# EasyEDA schematic SCH_Satlla_4_Motor_plate_2023-01-29.json
TITLE: Motor board; REV: 1.0; Date: 2021-09-02; Sheet: 1/1; Drawn By: KCG LAB; Company: Your Company
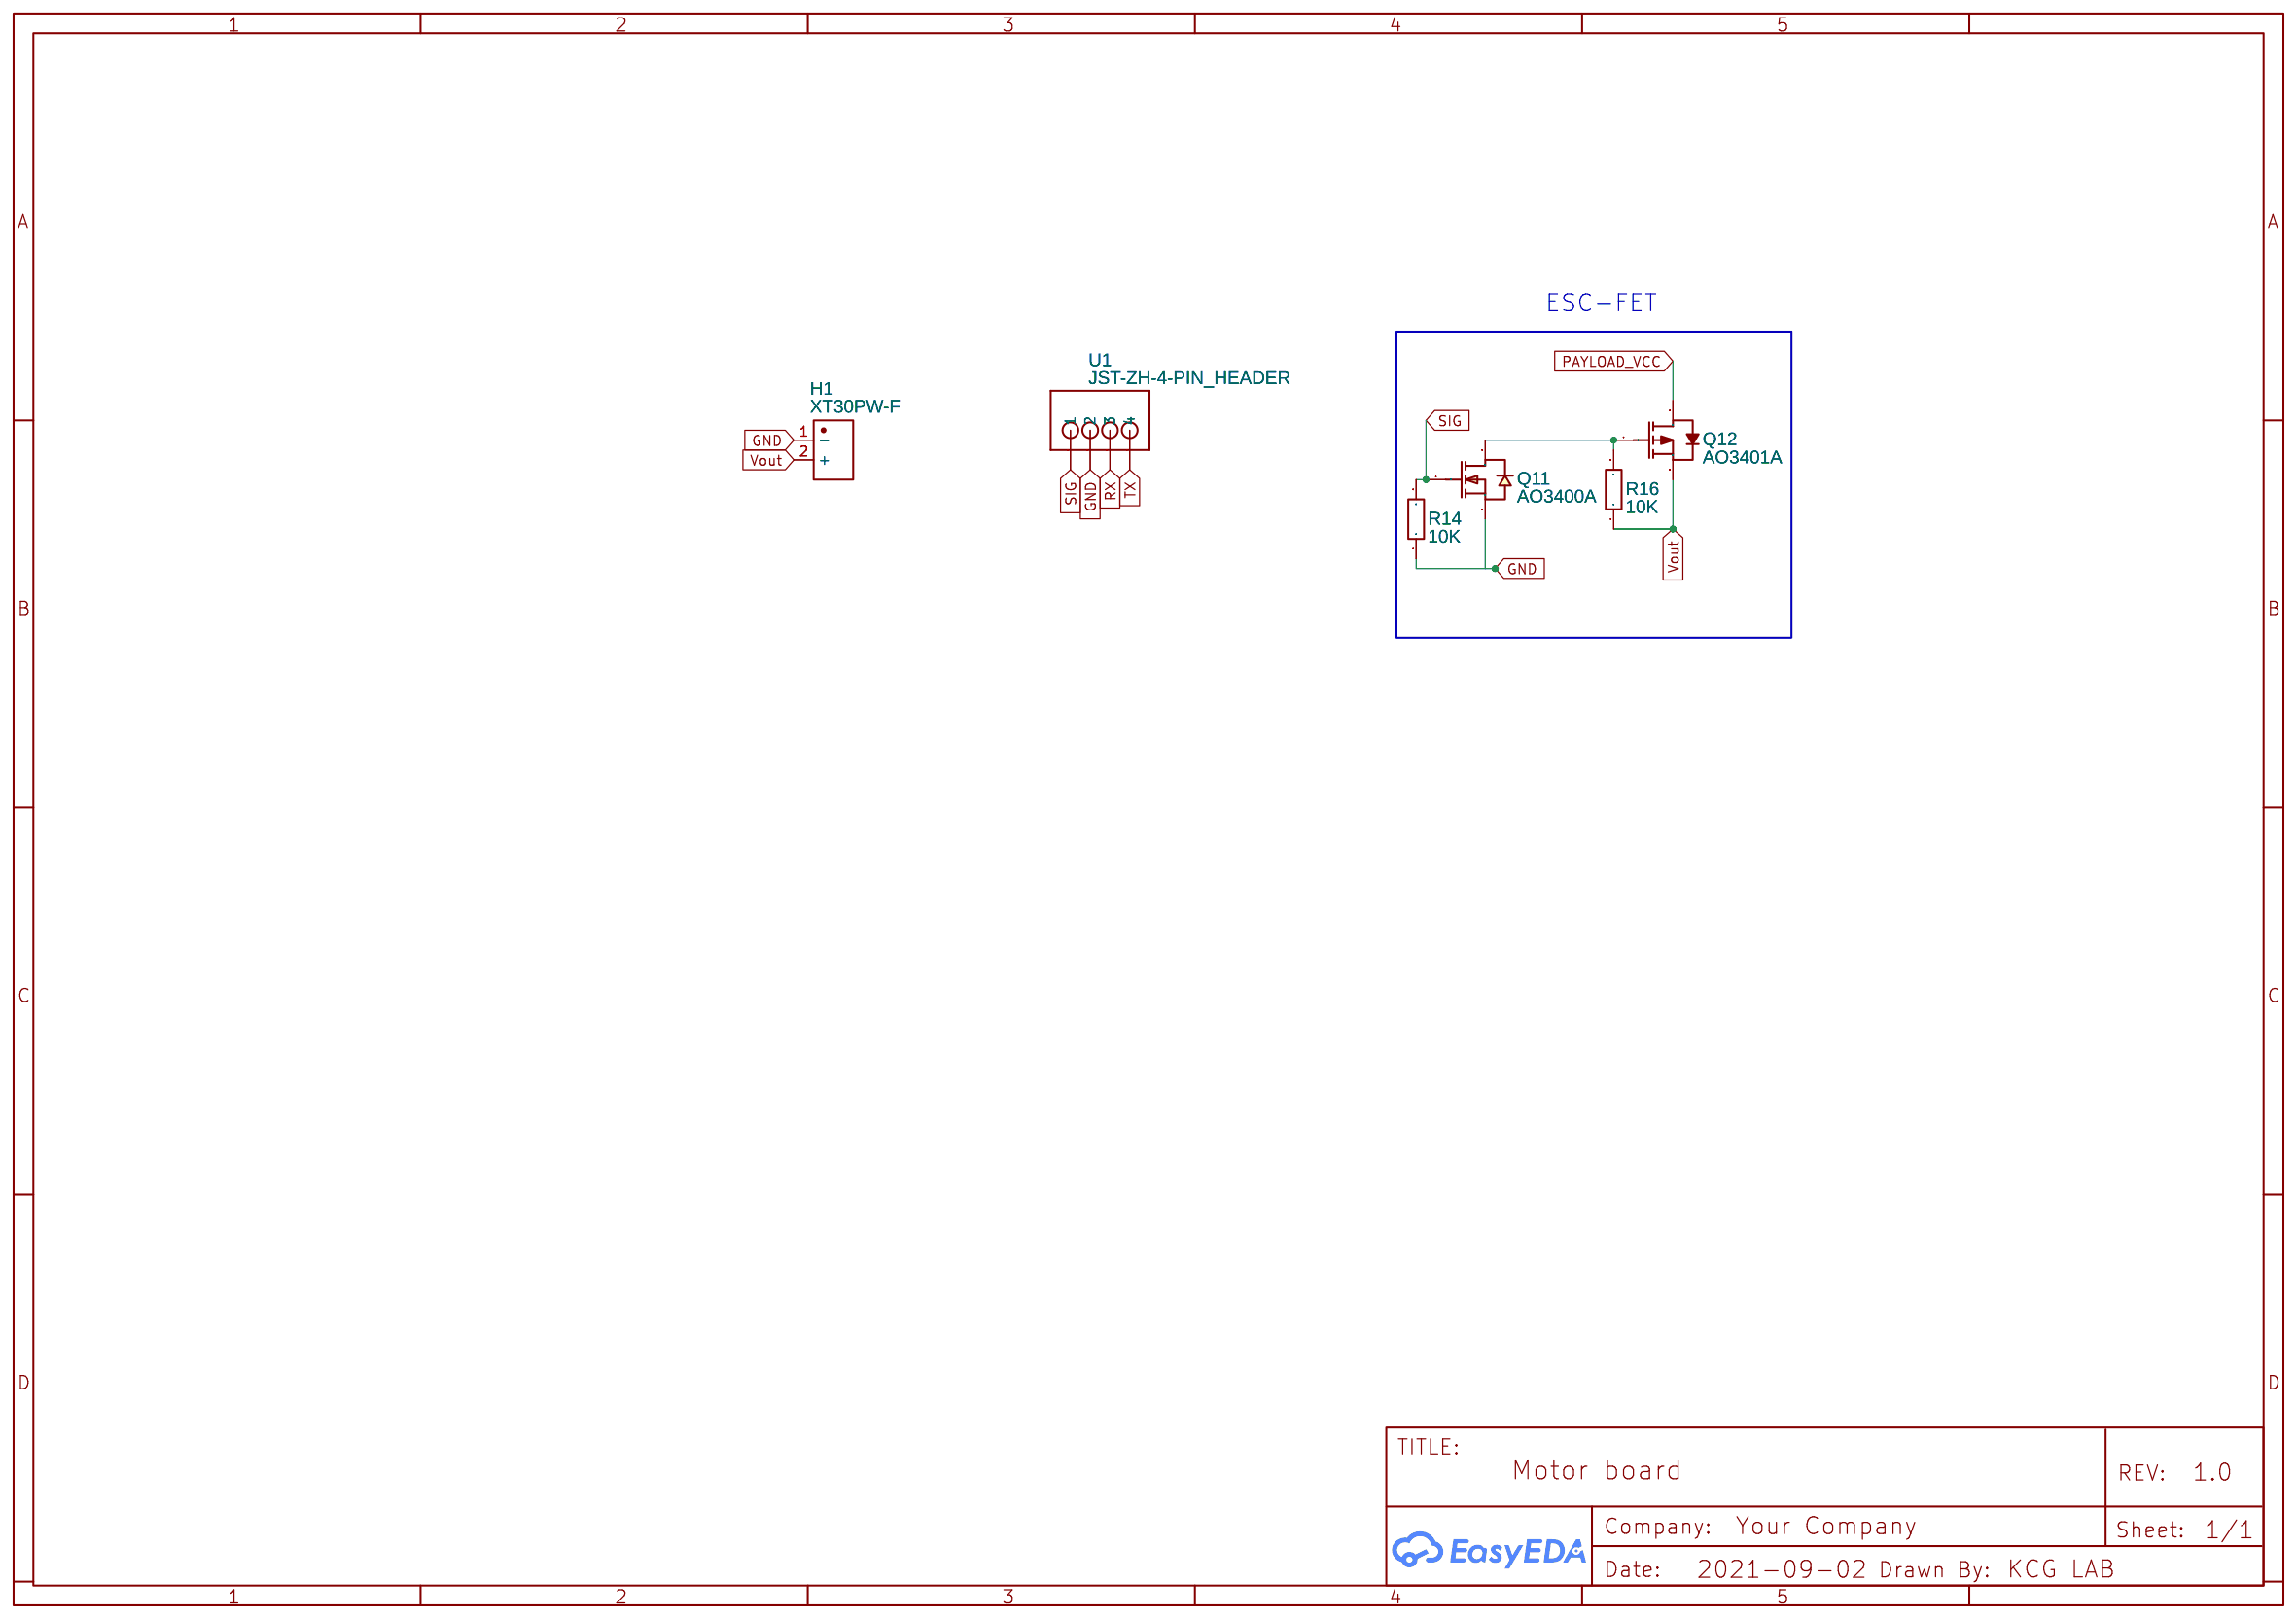
[diagram p0: schematic sheet]

## Parts
H1  XT30PW-F  [XT30PW-F]
Q11  AO3400A  [SOT-23-3_L2.9-W1.6-P1.90-LS2.8-BR]
Q12  AO3401A  [SOT-23_L2.9-W1.3-P1.90-LS2.4-BR]
R14  10K  [R0603]
R16  10K  [R0603]
U1  JST-ZH-4-PIN_HEADER  [JST-ZH-4 1.5MM]

## Library data of the parts
H1 = XT30PW-F: Manufacturer: Amass; Manufacturer Part: XT30PW; Supplier: banggood; Supplier Part: 1075324; link: https://www.banggood.com/5Pairs-Amass-XT30PW-30A-Low-Temperature-Rise-Fire-Retardant-Plug-p-1075324.html?cur_warehouse=CN; Contributor: Gonun
Q11 = AO3400A: Supplier: LCSC; Manufacturer: AOS; image: //image.lceda.cn/szlcsc/C20917.jpg; Supplier Part: C20917; SMT Type: Basic; JLCPCB SMD: Yes; LCSC Assembly: Yes
Q12 = AO3401A: Supplier: LCSC; Manufacturer: AOS; Supplier Part: C15127; JLCPCB Part Class: Basic Part; Package Display: No
R14 R16 = 0603WAF1002T5E: Supplier: LCSC; Manufacturer: UniOhm; Supplier Part: C25804; SMT Type: Basic; JLCPCB SMD: Yes; LCSC Assembly: Yes
U1 = JST-ZH-4-PIN_HEADER

## Nets
GND: H1.1(-) Q11.2(S) R14.1 U1.P2(2)
PAYLOAD_VCC: Q12.3(D)
RX: U1.P3(3)
SIG: Q11.1(G) R14.2 U1.P1(1)
TX: U1.P4(4)
Vout: H1.2(+) Q12.2(S) R16.1
Net-(Q11-3): Q11.3(D) Q12.1(G) R16.2

## Notes on the sheet
- ESC-FET
